# EAGLE design adapters (EAGLE 9.4.2)
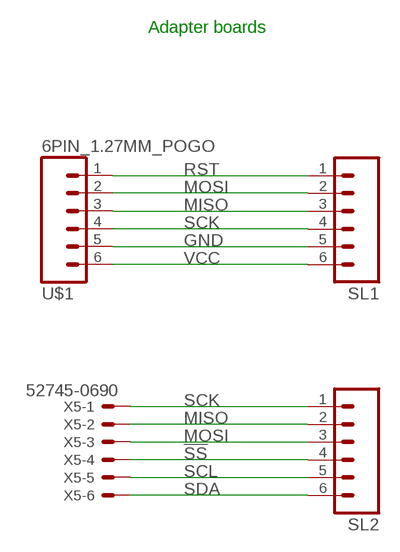
[diagram p0: schematic, sheet 1]

## Parts
SL1  M06  [06P]
SL2  M06  [06P]
U$1  6PIN_1.27MM_POGO  [1X06-1.27MM_POGO]
X5  52745-0690  [52745-0690]

## Nets
!SS: SL2.4 X5.4
GND: SL1.5 U$1.5
MISO: SL1.3 SL2.2 U$1.3 X5.2
MOSI: SL1.2 SL2.3 U$1.2 X5.3
RST: SL1.1 U$1.1
SCK: SL1.4 SL2.1 U$1.4 X5.1
SCL: SL2.5 X5.5
SDA: SL2.6 X5.6
VCC: SL1.6 U$1.6

## Notes on the sheet
- Adapter boards

## Library data of the parts
SL1 SL2 = con-amp-quick:M06: AMP QUICK CONNECTOR; OC_FARNELL: unknown; OC_NEWARK: unknown
U$1 = i2c_encoder:6PIN_1.27MM_POGO
X5 = i2c_encoder:52745-0690: FFC/FPC-to-Board 0.50mm (.020") SMT Top Contact Right Angle, ZIF, Style Receptacle 52745 / 52435 Source: http://www.molex.com/product/ffc/52745.html; MF: MOLEX; MPN: 52745-0690; OC_FARNELL: unknown; OC_NEWARK: 92M6374

## Board
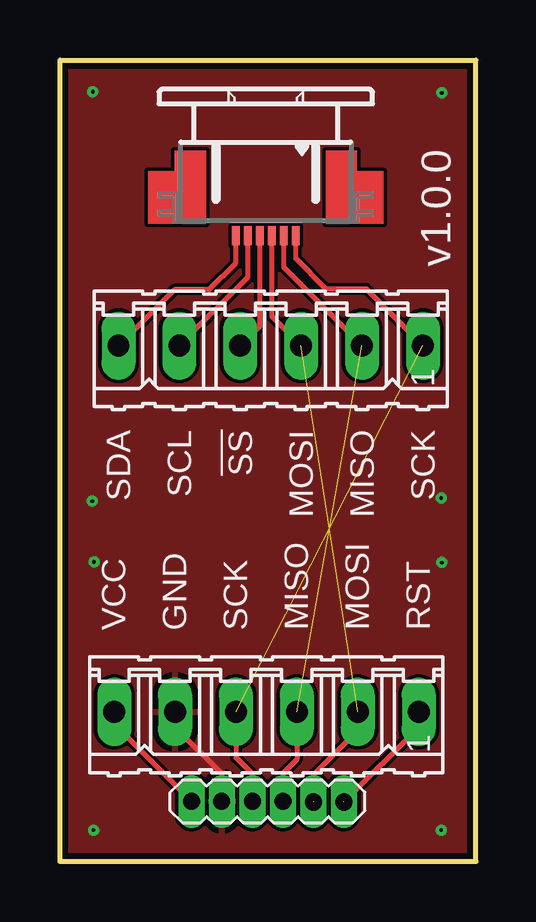
[diagram p1: board, top side]
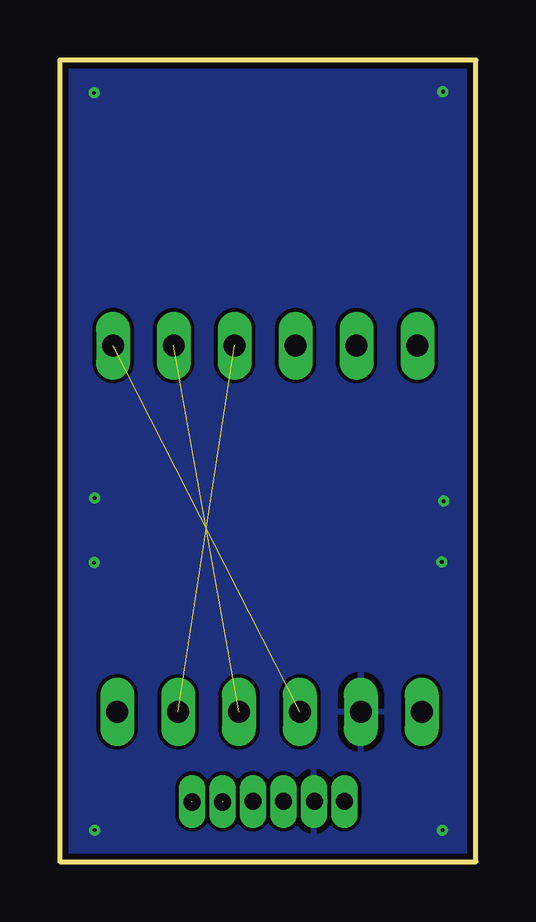
[diagram p2: board, bottom side, seen from below]

Size 17.35 x 33.43 mm. Coordinates in mm from the lower left corner, seen from the top.
Outline: 17.35,0 0,0 0,33.43 17.35,33.43 17.35,0
Copper layers (1*16): Top 0.035mm / dielectric 1.5mm / Bottom 0.035mm
Design rules "SeeedStudio_2layer_DRU_no_angle_20140221": minimum track width 6mil, minimum drill 12mil, track to track 6mil, track to pad 6mil, pad to pad 6mil, via to via 6mil, smd to smd 0mil, copper to edge 10mil, drill to drill 10mil, minimum pad ring 10mil, minimum via ring 6mil, stop-mask expansion 2mil, vias tented up to drill 100mil, thermal gap 10mil

### Footprints (pad centres in the part's own frame; a part is rotated, then mirrored left to right if it is on the bottom)
06P = drill 0.914 long: 1 -6.35,0; 2 -3.81,0; 3 -1.27,0; 4 1.27,0; 5 3.81,0; 6 6.35,0
1X06-1.27MM_POGO = drill 0.6 long: 1 0,0; 2 1.27,0; 3 2.54,0; 4 3.81,0; 5 5.08,0; 6 6.35,0
52745-0690 = smd 0.3 x 0.8: 1 -1.25,2.5; 2 -0.75,2.5; 3 -0.25,2.5; 4 0.25,2.5; 5 0.75,2.5; 6 1.25,2.5

### Placement (x,y rotation side)
SL1  8.61,6.25 180 top
SL2  8.79,21.51 180 top
U$1  11.84,2.51 180 top
X5  8.59,28.6 180 top

### Tracks (layer width: path | path; a pad name or v marks a point on that pad's centre or on a via)
!SS
  Top 0.203: SL2.4 8.34,22.33 X5.4
GND  (via drill 0.15, 0.71)
  Top 0.203: SL1.5 4.8,5.61 6.73,3.68 6.73,2.72 | 6.73,2.72 v6.73,2.52 | U$1.5 6.76,2.69 6.73,2.72
  other vias: 15.9,1.32 15.93,12.47 1.42,12.5 1.4,1.32 15.93,32.05 15.9,15.16 1.35,15.04 1.37,32.11
  pour Top: 0.03,33.43 0.03,0 17.32,0 17.32,33.43
  pour Bottom: 0.03,33.43 0.03,0 17.32,0 17.32,33.43
MISO  (via drill 0.71)  (1 unrouted)
  Top 0.203: U$1.3 9.3,3.68 9.88,4.27 SL1.3 | SL2.2 9.34,24.78 X5.2
  other vias: 9.3,2.51
MOSI  (via drill 0.71)  (2 unrouted)
  Top 0.203: v10.57,2.49 10.57,3.63 12.42,5.49 SL1.2 | SL2.3 8.84,22.74 X5.3
RST  (via drill 0.71)  (1 unrouted)
  Top 0.203: v11.84,2.49 14.96,5.61 SL1.1
SCK  (via drill 0.71)  (1 unrouted)
  Top 0.203: U$1.4 8.03,3.66 7.34,4.34 SL1.4 | X5.1 9.84,25.14 11.1,23.88 12.78,23.88 SL2.1
  other vias: 8.03,2.51
SCL
  Top 0.203: SL2.5 7.84,24.37 X5.5
SDA
  Top 0.203: X5.6 7.33,25.85 7.33,24.96 6.22,23.85 4.77,23.85 SL2.6
VCC  (via drill 0.71)
  Top 0.203: SL1.6 2.26,5.74 U$1.6
  other vias: 5.49,2.51

### Text on the board
tNames: v1.0.0 | SDA | SCL | !SS | MOSI | MISO | SCK | VCC | GND | SCK | MISO | MOSI | RST
Document: the height of an SK6812 is 1.6mm where / as the height for a smd encoder is ~4.5mm | Siirrä X3 ylemmäs? | use WS2812B or SK6812 to save on gpio pins | (0.1 -0.03) | GPIO needed: / I2C: 2 / SPI: 4 (+ interrupt?) / encoder: 2 / leds: 1 / = 5 - 7(/8) | (-0.1 -0.03) | (c> 2 1.9) | 0.5mm FFC max current = 0.55A / http://www.axon-cable.com/publications/FFC-Flat-Cables.pdf | CUTOUT | CUTOUT | F+M headerit päällekkäin on noin 5.1mm? | kooderin korkeus 4+(5-7 kierteet)mm | (0.03 0.1)